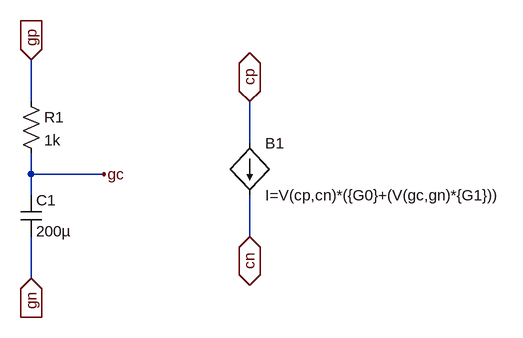
[diagram p0: schematic GasSensor.asc]
GasSensor.asc, the LTspice schematic file:
Version 4
SHEET 1 880 680
WIRE -64 -48 -64 -112
WIRE 272 16 272 -48
WIRE -64 64 -64 32
WIRE 48 64 -64 64
WIRE -64 96 -64 64
WIRE 272 160 272 96
WIRE -64 224 -64 160
FLAG -64 -112 gp
IOPIN -64 -112 In
FLAG -64 224 gn
IOPIN -64 224 In
FLAG 272 -48 cp
IOPIN 272 -48 BiDir
FLAG 272 160 cn
IOPIN 272 160 BiDir
FLAG 48 64 gc
SYMBOL res -80 -64 R0
SYMATTR InstName R1
SYMATTR Value 1k
SYMBOL cap -80 96 R0
SYMATTR InstName C1
SYMATTR Value 200µ
SYMBOL bi 272 16 R0
SYMATTR InstName B1
SYMATTR Value I=V(cp,cn)*({G0}+(V(gc,gn)*{G1}))

The netlist it stands for:
* GasSensor.asc
R1 gp gc 1k
C1 gc gn 200µ
B1 cp cn I=V(cp,cn)*({G0}+(V(gc,gn)*{G1}))
.backanno
.end